# Altium project Power Distribution Board.PrjPcb
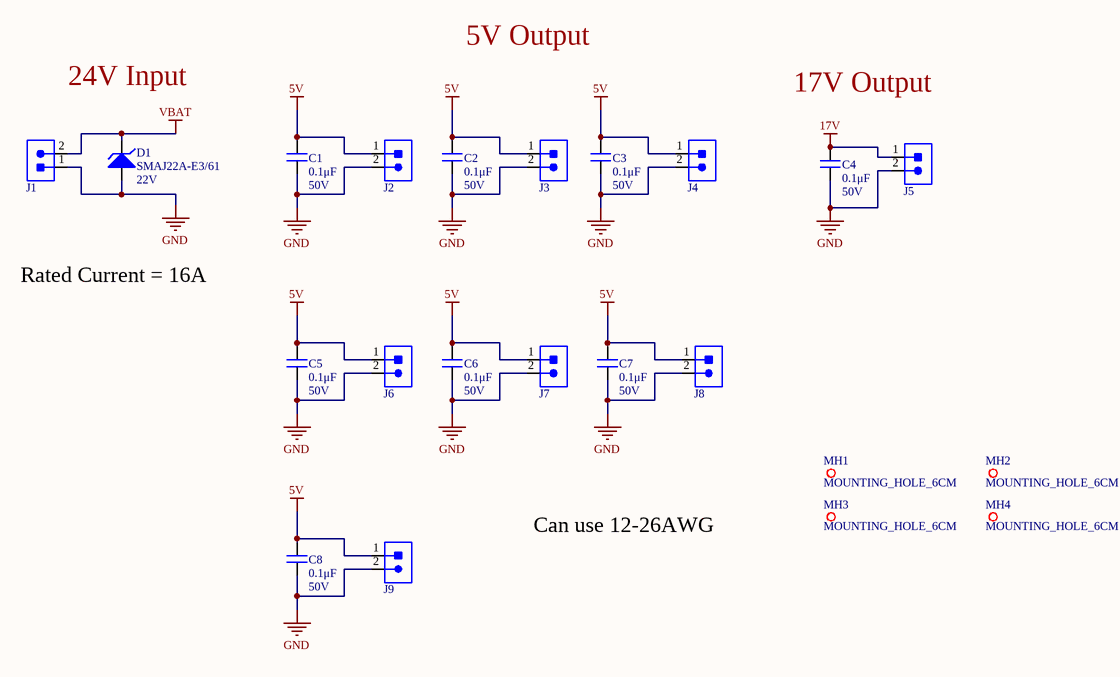
[diagram p0: SH1 - CONNECTORS.SchDoc]
BoardName: PDB
3 sheets, 83 parts. Net scope: global (net labels, ports and power ports of the same name join across sheets).
Board file: Power Distribution Board.PcbDoc
Sheets:
  SH1 - CONNECTORS.SchDoc
  SH2 - 5V VICOR DCDC.SchDoc
  SH3 - 17V BUCK CONVERTER.SchDoc

## Sheet SH1 - CONNECTORS.SchDoc: Connectors
size Letter; DrawnBy: Adrianna Ascalon; Organization: UW Robotics; Address1: 200 University Avenue; Address2: Waterloo; Address3: Ontario; Address4: Canada N2L 3G6; SheetNumber: 1; SheetTotal: 3

### Parts
C1  0.1μF  Voltage Rating: 50V  [CAPC2012X140N]
C2  0.1μF  Voltage Rating: 50V  [CAPC2012X140N]
C3  0.1μF  Voltage Rating: 50V  [CAPC2012X140N]
C4  0.1μF  Voltage Rating: 50V  [CAPC2012X140N]
C5  0.1μF  Voltage Rating: 50V  [CAPC2012X140N]
C6  0.1μF  Voltage Rating: 50V  [CAPC2012X140N]
C7  0.1μF  Voltage Rating: 50V  [CAPC2012X140N]
C8  0.1μF  Voltage Rating: 50V  [CAPC2012X140N]
D1  Reverse Standoff Voltage: 22V  [DO-214AC_UNI]  (hidden comment: SMAJ22A-E3/61)
J1  1935161  [1935161]  (value not drawn)
J2  1935161  [1935161]  (value not drawn)
J3  1935161  [1935161]  (value not drawn)
J4  1935161  [1935161]  (value not drawn)
J5  1935161  [1935161]  (value not drawn)
J6  1935161  [1935161]  (value not drawn)
J7  1935161  [1935161]  (value not drawn)
J8  1935161  [1935161]  (value not drawn)
J9  1935161  [1935161]  (value not drawn)
MH1  MOUNTING_HOLE_6CM  [MOUNTING_HOLE]
MH2  MOUNTING_HOLE_6CM  [MOUNTING_HOLE]
MH3  MOUNTING_HOLE_6CM  [MOUNTING_HOLE]
MH4  MOUNTING_HOLE_6CM  [MOUNTING_HOLE]

### Nets
5V: C1.2 C2.2 C3.2 C5.2 C6.2 C7.2 C8.2 J2.1 J3.1 J4.1 J6.1 J7.1 J8.1 J9.1
17V: C4.2 J5.1
GND: C1.1 C2.1 C3.1 C4.1 C5.1 C6.1 C7.1 C8.1 D1.1 J1.1 J2.2 J3.2 J4.2 J5.2 J6.2 J7.2 J8.2 J9.2
VBAT: D1.2 J1.2

### Notes on the sheet
- 5V Output
- 24V Input
- 17V Output
- Rated Current = 16A
- Can use 12-26AWG
- Title
- Size:
- Date:
- Letter
- Drawn By:
- Sheet
- of
- File:

### Library data of the parts
C1-C8 = CAP_0.1uF_50V_0805: CAP CER 0.1UF 50V X7R 0805; Manufacturer 1: Murata Electronics; Manufacturer Part Number 1: GCD21BR71H104KA01L; Tolerance: 10%; Mount: Surface Mount; Case Code (Metric): 2012; Case Code (Imperial): 0805; Min Operating Temperature: -55°C; Max Operating Temperature: 125°C; Dielectric: X7R; Termination: SMD/SMT; Length: 2mm; Height: 1.25mm; Width: 0.049inch; Thickness: 0.049inch; Depth: 1.25mm; Ratings: AEC-Q200; Supplier 1: Digi-Key; Supplier Part Number 1: 490-11955-1-ND; Package: 0805 (2012 Metric); Value: 0.1μF
D1 = SMAJ22A-E3/61: TVS DIODE 22V 35.5VC SMA; Manufacturer 1: Vishay Semiconductors; Clamping Voltage: 35.5V; Peak Pulse Power: 400W; Polarity: Unidirectional; Peak Pulse Current: 11.3A; Test Current: 1mA; Breakdown Voltage: 24.4V; Number of Channels: 1; Leakage Current: 1uA; Element Configuration: Single; Max Breakdown Voltage: 26.9V; Max Forward Surge Current (Ifsm): 40A; Working Voltage: 3.5V; Current: 113A; Supplier 1: Digi-Key; Case/Package: SMA; Number of Pins: 2; Min Operating Temperature: -55°C; Max Operating Temperature: 150°C; Max Surge Current: 11.3A; Operating Supply Voltage: 22V; Min Breakdown Voltage: 24.4V; Number of Elements: 1; Reverse Breakdown Voltage: 24.4V; Direction: Unidirectional; Termination: SMD/SMT; Max Reverse Leakage Current: 1uA; Max Power Dissipation: 400W; Voltage Rating (DC): 22V; Power Dissipation: 400W; Voltage: 22V; Length: 0.177inch; Height: 0.09inch; Width: 0.11inch; REACH SVHC: Unknown; Supplier Part Number 1: SMAJ22A-E3/61GICT-ND; Manufacturer Part Number 1: SMAJ22A-E3/61
J1 = CON_2M_TERM: TERM BLK 2POS SIDE ENTRY 5MM; Manufacturer 1: Phoenix Contact; Voltage: 300V; Current: 18A; Connector Type: Screw; Voltage Rating (DC): 320V; Max Current Rating: 16A; Max Supply Voltage: 250V; Current Rating: 17.5A; Number of Poles: 2; Number of Levels: 1; Wire Gauge (Max): 26AWG; Wire Gauge (Min): 12AWG; Approvals: UL; Supplier 1: Digi-Key; Pitch: 5mm; Manufacturer Part Number 1: 1935161; Supplier Part Number 1: 277-1667-ND; Mount: Through Hole; Number of Pins: 2; Weight: 0.067021oz; Contact Material: Copper,Tin; Insulation Material: Nylon; Housing Material: Polyamide; Housing Color: Green; Color: Green; Material: Nylon; Number of Rows: 1; Voltage Rating: 250V; Number of Positions: 2; Number of Positions Per Level: 2; Termination: Solder; Number of Contacts: 2; Number of Circuits: 2; Orientation: Straight; Length: 9mm; Height: 11.3mm; Width: 14.9mm; Depth: 9mm; Wire/Cable Gauge: 26AWG; Flammability Rating: UL94 V-0; REACH SVHC: Unknown
J2-J9 = CON_2M_TERM: TERM BLK 2POS SIDE ENTRY 5MM; Manufacturer 1: Phoenix Contact; Connector Type: Screw; Voltage Rating (DC): 320V; Max Current Rating: 16A; Max Supply Voltage: 250V; Current Rating: 17.5A; Number of Poles: 2; Number of Levels: 1; Current: 18A; Voltage: 300V; Wire Gauge (Max): 26AWG; Wire Gauge (Min): 12AWG; Approvals: UL; Supplier 1: Digi-Key; Mount: Through Hole; Number of Pins: 2; Weight: 0.067021oz; Contact Material: Copper,Tin; Insulation Material: Nylon; Housing Material: Polyamide; Housing Color: Green; Color: Green; Material: Nylon; Number of Rows: 1; Voltage Rating: 250V; Number of Positions: 2; Number of Positions Per Level: 2; Termination: Solder; Number of Contacts: 2; Number of Circuits: 2; Orientation: Straight; Length: 9mm; Height: 11.3mm; Width: 14.9mm; Pitch: 5mm; Depth: 9mm; Wire/Cable Gauge: 26AWG; Flammability Rating: UL94 V-0; REACH SVHC: Unknown; Supplier Part Number 1: 277-1667-ND; Manufacturer Part Number 1: 1935161

## Sheet SH2 - 5V VICOR DCDC.SchDoc: 5V Vicor Power Supply
size Letter; DrawnBy: Adrianna Ascalon; Organization: UW Robotics; Address1: 200 University Avenue; Address2: Waterloo; Address3: Ontario; Address4: Canada N2L 3G6; SheetNumber: 2; SheetTotal: 3
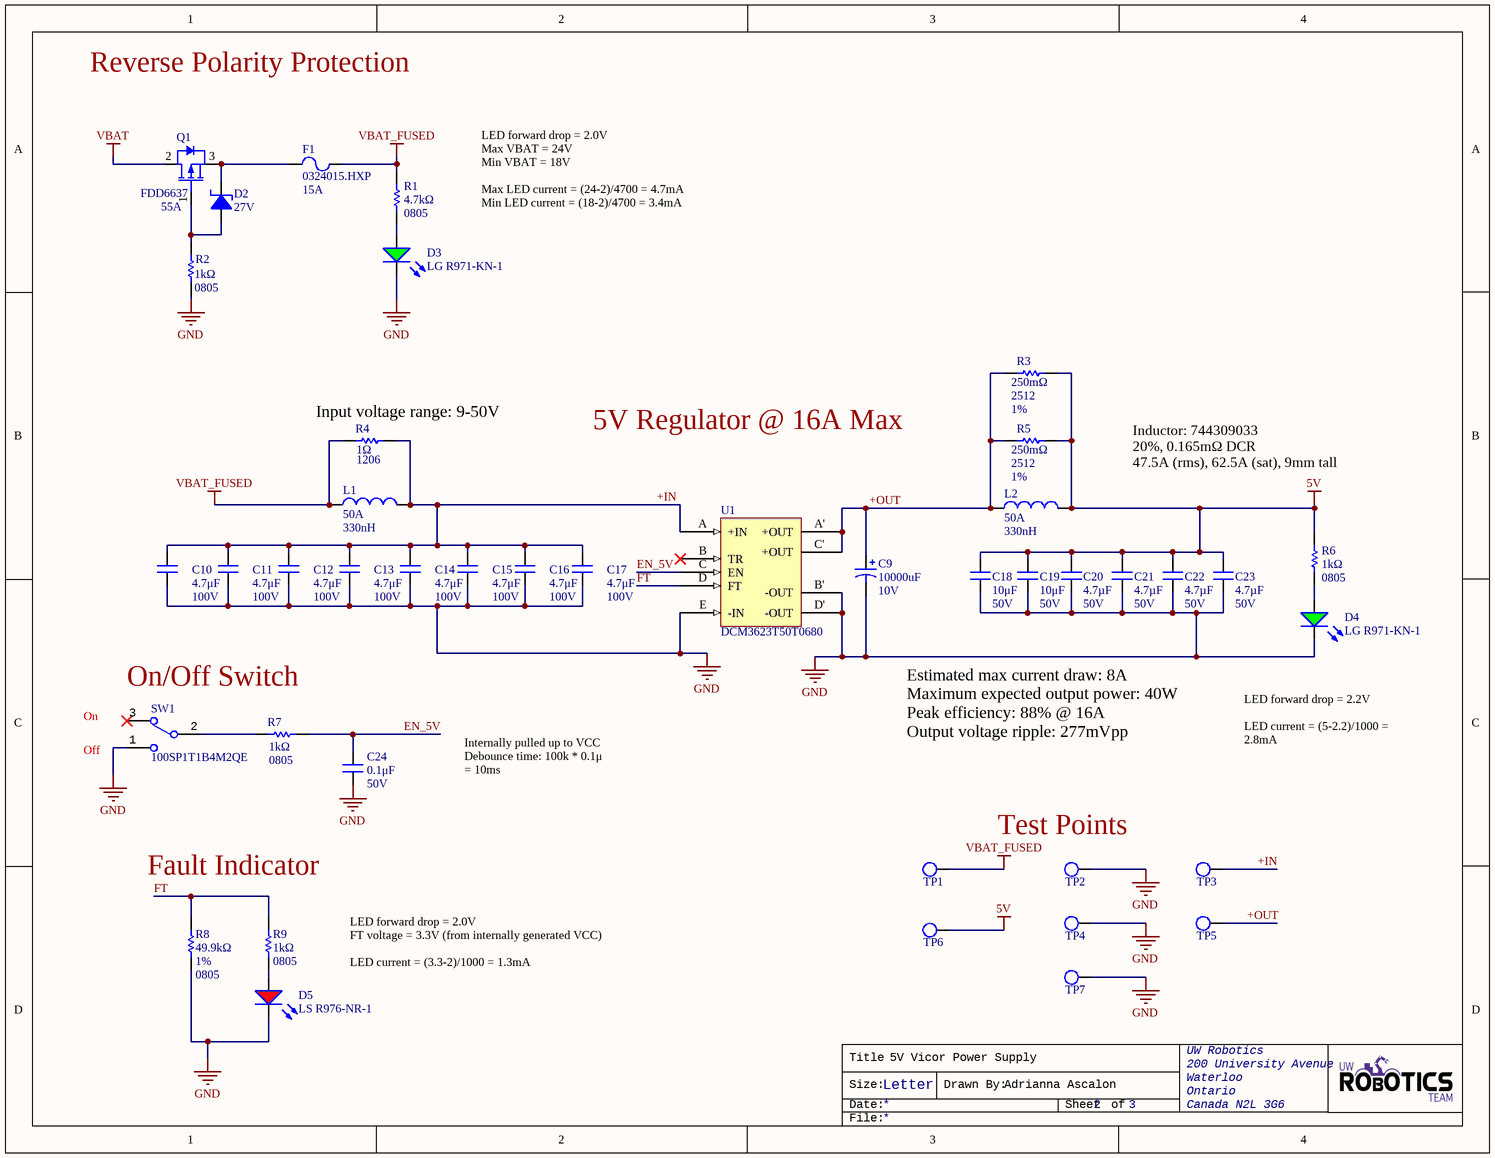
[diagram p1: SH2 - 5V VICOR DCDC.SchDoc]

### Parts
C9  Capacitance: 10000uF  Voltage Rating: 10V  [CAP_UBY_18X25_NC]  (hidden comment: URS1A103MHD1TN)
C10  4.7μF  Voltage Rating: 100V  [CAPC5750X7R2A]
C11  4.7μF  Voltage Rating: 100V  [CAPC5750X7R2A]
C12  4.7μF  Voltage Rating: 100V  [CAPC5750X7R2A]
C13  4.7μF  Voltage Rating: 100V  [CAPC5750X7R2A]
C14  4.7μF  Voltage Rating: 100V  [CAPC5750X7R2A]
C15  4.7μF  Voltage Rating: 100V  [CAPC5750X7R2A]
C16  4.7μF  Voltage Rating: 100V  [CAPC5750X7R2A]
C17  4.7μF  Voltage Rating: 100V  [CAPC5750X7R2A]
C18  value 10μF  Voltage Rating: 50V  [CAPC1206(3216)]  (hidden comment: 10uF)
C19  value 10μF  Voltage Rating: 50V  [CAPC1206(3216)]  (hidden comment: 10uF)
C20  4.7µF  Voltage: 50V  [CAPC1206(3216)]
C21  4.7µF  Voltage: 50V  [CAPC1206(3216)]
C22  4.7µF  Voltage: 50V  [CAPC1206(3216)]
C23  4.7µF  Voltage: 50V  [CAPC1206(3216)]
C24  0.1μF  Voltage Rating: 50V  [CAPC2012X140N]
D2  Working Voltage: 27V  [SOT23-3]  (hidden comment: DIO_ZENER_27V)
D3  LG R971-KN-1  [LED_0805_LINE]
D4  LG R971-KN-1  [LED_0805_LINE]
D5  LS R976-NR-1  [LED_0805_LINE]
F1  0324015.HXP  Current Rating: 15A  [FUSE]
L1  Max DC Current: 50A  Inductance: 330nH  [WE-HCM 1390]  (hidden comment: 744309033)
L2  Max DC Current: 50A  Inductance: 330nH  [WE-HCM 1390]  (hidden comment: 744309033)
Q1  Continuous Drain Current (ID): 55A  [D-PAK]  (hidden comment: FDD6637)
R1  value 4.7kΩ  Case Code (Imperial): 0805  [RESC2012X60N]  (hidden comment: RES_4.7kΩ_0805)
R2  1kΩ  Case Code (Imperial): 0805  [RESC2012X60N]
R3  Package Reference: 2512  Resistance Tolerance: 1%  Resistance: 250mΩ  [RESC6432X89X76NL25T25]  (hidden comment: WSL2512R2500FEA)
R4  Case Code (Imperial): 1206  Resistance: 1Ω  [RESC1206(3216)_N]  (hidden comment: RES_1Ω_1206)
R5  Package Reference: 2512  Resistance Tolerance: 1%  Resistance: 250mΩ  [RESC6432X89X76NL25T25]  (hidden comment: WSL2512R2500FEA)
R6  1kΩ  Case Code (Imperial): 0805  [RESC2012X60N]
R7  1kΩ  Case Code (Imperial): 0805  [RESC2012X60N]
R8  49.9kΩ  Tolerance: 1%  Case Code (Imperial): 0805  [RESC2012X60N]
R9  1kΩ  Case Code (Imperial): 0805  [RESC2012X60N]
SW1  100SP1T1B4M2QE  [100SP1T1B4M2QE]
TP1  TESTPOINT_LOOP  [TESTPOINT_LOOP]  (value not drawn)
TP2  TESTPOINT_LOOP  [TESTPOINT_LOOP]  (value not drawn)
TP3  TESTPOINT_LOOP  [TESTPOINT_LOOP]  (value not drawn)
TP4  TESTPOINT_LOOP  [TESTPOINT_LOOP]  (value not drawn)
TP5  TESTPOINT_LOOP  [TESTPOINT_LOOP]  (value not drawn)
TP6  TESTPOINT_LOOP  [TESTPOINT_LOOP]  (value not drawn)
TP7  TESTPOINT_LOOP  [TESTPOINT_LOOP]  (value not drawn)
U1  DCM3623T50T0680  [DCM3623T50T0680]

### Nets
5V: C18.2 C19.2 C20.2 C21.2 C22.2 C23.2 L2.2 R3.2 R5.2 R6.2 TP6.1
GND: C9.2 C10.1 C11.1 C12.1 C13.1 C14.1 C15.1 C16.1 C17.1 C18.1 C19.1 C20.1 C21.1 C22.1 C23.1 C24.1 D3.2(K) D4.2(K) D5.2(K) R2.1 R8.2 SW1.1 TP2.1 TP4.1 TP7.1 U1.B'(-OUT) U1.D'(-OUT) U1.E(-IN)
VBAT: Q1.2(Drain)
VBAT_FUSED: F1.2 L1.1 R1.2 R4.1 TP1.1
+IN: C10.2 C11.2 C12.2 C13.2 C14.2 C15.2 C16.2 C17.2 L1.2 R4.2 TP3.1 U1.A(+IN)
+OUT: C9.1 L2.1 R3.1 R5.1 TP5.1 U1.A'(+OUT) U1.C'(+OUT)
EN_5V: C24.2 R7.2 U1.C(EN)
FT: R8.1 R9.2 U1.D(FT)
NetD2_1: D2.1(Anode) Q1.1(Gate) R2.2
NetD2_2: D2.2(Cathode) F1.1 Q1.3(Source)
NetD3_1: D3.1(A) R1.1
NetD4_1: D4.1(A) R6.1
NetD5_1: D5.1(A) R9.1
NetR7_1: R7.1 SW1.2

Not connected (* = marked no-connect by the designer): SW1 3*; U1 B(TR)*

### Notes on the sheet
- Reverse Polarity Protection
- LED forward drop = 2.0V
  Max VBAT = 24V
  Min VBAT = 18V
  Max LED current = (24-2)/4700 = 4.7mA
  Min LED current = (18-2)/4700 = 3.4mA
- (near R4) Input voltage range: 9-50V
- 5V Regulator @ 16A Max
- Inductor: 744309033
  20%, 0.165mΩ DCR
  47.5A (rms), 62.5A (sat), 9mm tall
- On/Off Switch
- (near SW1) Off
- On
- Internally pulled up to VCC
  Debounce time: 100k * 0.1μ = 10ms
- Estimated max current draw: 8A
  Maximum expected output power: 40W
  Peak efficiency: 88% @ 16A
  Output voltage ripple: 277mVpp
- LED forward drop = 2.2V
  LED current = (5-2.2)/1000 = 2.8mA
- (near TP2) Test Points
- Fault Indicator
- LED forward drop = 2.0V
  FT voltage = 3.3V (from internally generated VCC)
  LED current = (3.3-2)/1000 = 1.3mA
- Title
- Size:
- Date:
- Letter
- Drawn By:
- Sheet
- of
- File:

### Library data of the parts
C9 = URS1A103MHD1TN: CAP ALUM 10000UF 20% 10V RADIAL; Manufacturer 1: Nichicon; Ripple Current: 2.35A; Life (Hours): 2000Hour; Supplier 1: Digi-Key; Manufacturer Part Number 1: URS1A103MHD1TN; Mount: Through Hole; Case/Package: Radial; Min Operating Temperature: -40°C; Max Operating Temperature: 85°C; Tolerance: 20%; Lead Pitch: 0.295inch; Height - Seated (Max): 1.043inch; Supplier Part Number 1: 493-12364-1-ND
C10-C17 = CAP_4.7uF_100V_2220: CAP CER 4.7UF 100V X7R 2220; Manufacturer: TDK; Manufacturer Part Number: C5750X7R2A475M230KA; Tolerance: 20%; Supplier Part Number 1: 445-1450-1-ND; Supplier 1: Digi-Key; Category: Ceramic Capacitors; Mount: Surface Mount; Number of Pins: 2; Weight: 0.016932oz; Case Code (Metric): 5750; Case Code (Imperial): 2220; Min Operating Temperature: -55°C; Max Operating Temperature: 125°C; Termination: SMD/SMT; Voltage: 100V; Voltage Rating (DC): 100V; Dielectric: X7R; Composition: Ceramic; Length: 5.7mm; Height: 2.3mm; Depth: 5mm; Width: 0.197inch; Thickness: 0.098inch; REACH SVHC: No SVHC; Capacitor Value: 4.7μF; Package: 2220 (5750 Metric); Value: 4.7μF
C18 C19 = CAP_10uF_50V_1206: CAP CER 10UF 50V X5R 1206; Manufacturer Part Numer 1: GRT31CR61H106KE01L; Manufacturer 1: Murata; Dimensions: 0.126" L x 0.063" W (3.20mm x 1.6mm); Package: 1206 (3216 Metric); Supplier Part Number 1: 490-12456-1-ND; Supplier 1: Digi-Key; Mount: Surface Mount; Case Code (Imperial): 1206; Case Code (Metric): 3216; Dielectric: X5R; Manufacturer Part Number 1: GRT31CR61H106KE01L
C20-C23 = CAP_4.7µF_50V_1206: CAP CER 4.7UF 50V X7R 1206; Manufacturer 1: Murata; Manufacturer Part Number 1: GRM31CR71H475KA12L; Material: Ceramic; Tolerance: 10%; Capacitance: 4.7uF; Voltage Rating: 50V; Supplier 1: Digi-Key; Mount: Surface Mount; Case Code (Metric): 3216; Case Code (Imperial): 1206; Min Operating Temperature: -55°C; Max Operating Temperature: 125°C; Voltage Rating (DC): 50V; Termination: SMD/SMT; Dielectric: X7R; Length: 3.2mm; Height: 1.6mm; Width: 0.063inch; Thickness: 0.071inch; Depth: 1.6mm; REACH SVHC: No SVHC; ComponentLink7URL: https://datasheet.ciiva.com/6270/partnumbering-e-01-6270217.pdf?src-supplier=Digi-Key; ComponentLink7Description: https://datasheet.ciiva.com/6270/partnumbering-e-01-6270217.pdf?src-supplier=Digi-Key; ComponentLink8URL: https://datasheet.ciiva.com/6270/partnumbering-e-01-6270218.pdf?src-supplier=Digi-Key; ComponentLink8Description: https://datasheet.ciiva.com/6270/partnumbering-e-01-6270218.pdf?src-supplier=Digi-Key; Supplier Part Number 1: 490-6521-1-ND; Package: 1206 (3216 Metric)
C24 = CAP_0.1uF_50V_0805: CAP CER 0.1UF 50V X7R 0805; Manufacturer Part Number 1: GCD21BR71H104KA01L; Manufacturer 1: Murata Electronics; Tolerance: 10%; Package: 0805 (2012 Metric); Supplier Part Number 1: 490-11955-1-ND; Supplier 1: Digi-Key; Mount: Surface Mount; Value: 0.1μF; Case Code (Imperial): 0805; Case Code (Metric): 2012; Dielectric: X7R; Min Operating Temperature: -55°C; Max Operating Temperature: 125°C; Termination: SMD/SMT; Length: 2mm; Height: 1.25mm; Width: 0.049inch; Thickness: 0.049inch; Depth: 1.25mm; Ratings: AEC-Q200
D2 = DIO_ZENER_27V: DIODE ZENER 27V 250MW SOT23; Manufacturer 1: Nexperia USA Inc.; Manufacturer Part Number 1: BZX84-C27,215; Tolerance: 5%; Forward Voltage: 0.9V; Supplier Part Number 1: 1727-5026-2-ND; Supplier 1: Digi-Key; Mount: Surface Mount; Package/Case: SOT-23-3
D3 D4 = DIO_LED_G: LED GREEN DIFFUSED 0805 SMD; Manufacturer 1: OSRAM; Forward Voltage Drop: 2.2V; Package: 0805 (2012 Metric); Manufacturer Part Number 1: LG R971-KN-1; Supplier Part Number 1: 475-1410-1-ND; Supplier 1: Digi-Key; Mount: Surface Mount
D5 = DIO_LED_R: LED RED DIFFUSED 0805 SMD; Manufacturer 1: OSRAM; Forward Voltage Drop: 2V; Package: 0805 (2012 Metric); Manufacturer Part Number 1: LS R976-NR-1; Supplier Part Number 1: 475-1278-1-ND; Supplier 1: Digi-Key; Mount: Surface Mount
F1 = 0324015.HXP: FUSE CERM 15A 250VAC 125VDC 3AB; Manufacturer 1: Littelfuse; Fuse Type: Cartridge, Ceramic; Voltage Rating (DC): 125V; Voltage Rating (AC): 250V; DC Cold Resistance: 5.05mR; Approvals: UL,CSA,CE,K-Mark; Supplier 1: Digi-Key; Manufacturer Part Number 1: 0324015.HXP; Mount: Through Hole; Case/Package: Axial; Housing Material: Ceramic; Min Operating Temperature: -55°C; Max Operating Temperature: 125°C; Termination: Axial; Fuse Current: 15A; Resistance: 5.05mR; Working Voltage: 250V; Diameter: 6.985mm; Length: 1.288inch; REACH SVHC: Unknown; Supplier Part Number 1: F1870-ND
L1 L2 = 744309033: IND 330NH 47.5A 0.165 MOHM; Manufacturer 1: Wurth Electronics; Core Material: Zinc; Inductance Tolerance: 20%; Self Resonant Frequency: 158MHz; Saturation Current: 62.5A; Shielding: Shielded; DC Resistance (DCR): 0.165mR; Test Frequency: 100kHz; Supplier 1: Newark; Manufacturer Part Number 1: 744309033; Mount: Surface Mount; Case/Package: Nonstandard; Min Operating Temperature: -40°C; Max Operating Temperature: 125°C; Current Rating: 47.5A; Tolerance: 20%; Composition: Wirewound; Termination: SMD/SMT; RMS Current (Irms): 50A; Length: 0.551inch; Height: 9mm; Width: 0.512inch; Height - Seated (Max): 0.374inch; REACH SVHC: Unknown
Q1 = FDD6637: MOSFET P-CH 35V 13A DPAK; Manufacturer 1: ON Semiconductor / Fairchild; Rds On Max: 11.6mR; Input Capacitance: 2.37nF; Max Power Dissipation: 57W; Rise Time: 10ns; Fall Time: 36ns; Turn-Off Delay Time: 62ns; Turn-On Delay Time: 18ns; Gate to Source Voltage (Vgs): 25V; Element Configuration: Single; Number of Elements: 1; Power Dissipation: 3.1W; Drain to Source Breakdown Voltage: -35V; Threshold Voltage: -1.6V; Supplier 1: Digi-Key; Mount: Surface Mount; Case/Package: TO-252; Number of Pins: 3; Weight: 0.26037g; Min Operating Temperature: -55°C; Max Operating Temperature: 150°C; Drain to Source Voltage (Vdss): 35V; Drain to Source Resistance: 11.6mR; Nominal Vgs: -1.6V; On-State Resistance: 11.6MR; Length: 6.73mm; Height: 2.39mm; Width: 6.22mm; REACH SVHC: No SVHC; ComponentLink7URL: https://datasheet.ciiva.com/28548/686553-28548172.pdf?src-supplier=Element14; ComponentLink7Description: https://datasheet.ciiva.com/28548/686553-28548172.pdf?src-supplier=Element14; ComponentLink8URL: https://datasheet.ciiva.com/6382/fdd6637-6382456.pdf?src-supplier=Digi-Key; ComponentLink8Description: https://datasheet.ciiva.com/6382/fdd6637-6382456.pdf?src-supplier=Digi-Key; ComponentLink9URL: https://datasheet.ciiva.com/6382/fdd6637-6382457.pdf?src-supplier=Digi-Key; ComponentLink9Description: https://datasheet.ciiva.com/6382/fdd6637-6382457.pdf?src-supplier=Digi-Key; Supplier Part Number 1: FDD6637CT-ND; Manufacturer Part Number 1: FDD6637
R1 = RES_4.7kΩ_0805: RES SMD 4.7K OHM 5% 1/8W 0805; Manufacturer 1: Yageo; Manufacturer Part Number 1: RC0805JR-074K7L; Resistance: 4.7kR; Temperature Coefficient: 100ppm/°C; Power Rating: 125mW; Voltage Rating: 150V; Supplier 1: Digi-Key; Contact Plating: Tin,Lead,Matte; Case Code (Metric): 2012; Min Operating Temperature: -55°C; Max Operating Temperature: 155°C; Tolerance: 5%; Composition: Thick Film; Termination: SMD/SMT; Military Standard: Not; Length: 2mm; Depth: 1.25mm; REACH SVHC: Unknown; Supplier Part Number 1: 311-4.7KARCT-ND; Mount: Surface Mount; Package: 0805 (2012 Metric)
R2 R6 R9 = RES_1kΩ_0805: RES SMD 1K OHM 1% 1/8W 0805; Manufacturer 1: Yageo; Manufacturer Part Number 1: RC0805FR-071KL; Power Rating: 125mW; Temperature Coefficient: 25ppm/°C; Voltage Rating: 150V; Package: 0805 (2012 Metric); Supplier Part Number 1: 311-1.00KCRCT-ND; Supplier 1: Digi-Key; Case Code (Metric): 2012; Tolerance: 1%; Value: 1kΩ; Min Operating Temperature: -55°C; Max Operating Temperature: 155°C; Resistance: 1K; Termination: SMD/SMT; Mount: Surface Mount; Case/Package: 0805; Number of Pins: 2; Weight: 0.000194oz; Contact Plating: Tin; Composition: Thin Film; Number of Terminations: 2; Voltage Rating (DC): 150V; Max Power Dissipation: 125mW; Features: Moisture Resistant,Automotive AEC-Q200,Anti-Sulfur; Military Standard: Not; Length: 2mm; Height: 0.022inch; Width: 0.049inch; Depth: 1.25mm; REACH SVHC: Unknown
R3 R5 = RES_250mΩ_2512: RES 0.25 OHM 1% 1W 2512; Manufacturer: Vishay; Automotive Qualification Standard: AEC-Q200; Temperature Coefficient: ±75ppm/°C; Resistor Case Style: 2512[6432Metric]; SVHC: NoSVHC(15-Jun-2015); Product Range: WSLSeries; Resistor Element Type: MetalStrip; Power Rating: 1W; Manufacturer URL: http://www.vishay.com/; Datasheet Version: 07/2016; Datasheet URL: http://www.vishay.com/docs/30100/wsl.pdf; Mounting Technology: SurfaceMount; MSL: MSL1-Unlimited; Package Description: 2-Pin Surface Mount Device, Body 6.35 x 3.18 mm; Case Code (Imperial): 2512; Case Code (Metric): 6432; Package: 2512 (6432 Metric)
R4 = RES_1Ω_1206: RES 1 OHM 5% 1/4W 1206; Manufacturer: KOA Speer; Manufacturer Part Number: RK73B2BTTE1R0J; Power Rating: 250mW; Voltage Rating: 200V; Temperature Coefficient: 200ppm/°C; Supplier 1: Digi-Key; Category: Chip SMD Resistors; Case Code (Metric): 3216; Min Operating Temperature: -55°C; Max Operating Temperature: 155°C; Tolerance: 5%; Termination: SMD/SMT; Composition: Thick Film; Length: 3.2mm; Height: 0.6mm; Width: 1.6mm; Supplier Part Number 1: 2019-RK73B2BTTE1R0JCT-ND; Package: 1206 (3216 Metric)
R7 = RES_100kΩ_0805: RES SMD 100K OHM 0.5% 1/8W 0805; Manufacturer 1: Panasonic; Manufacturer Part Number 1: ERA-6AED104V; Resistance: 100kΩ; Power Rating: 125mW; Temperature Coefficient: 25ppm/°C; Voltage Rating: 200V; Package: 0805 (2012 Metric); Supplier Part Number 1: P123795CT-ND; Supplier 1: Digi-Key; Case Code (Metric): 2012; Tolerance: 0.5%; Min Operating Temperature: -55°C; Max Operating Temperature: 155°C; Termination: SMD/SMT; Mount: Surface Mount; Contact Plating: Tin; Composition: Thin Film; Military Standard: Not; Length: 2mm; Height: 0.5mm; Width: 1.25mm; Depth: 1.25mm; Category: Chip SMD Resistors
R8 = RES_49.9kΩ_0805: RES SMD 49.9K OHM 1% 1/8W 0805; Manufacturer Part Number 1: TNPW080549K9BEEN; Manufacturer 1: Vishay Dale; Power Rating: 125mW; Voltage Rating: 150V; Temperature Coefficient: 25ppm/°C; Resistance: 49.9kR; Supplier 1: Digi-Key; Mount: Surface Mount; Number of Pins: 2; Min Operating Temperature: -55°C; Max Operating Temperature: 125°C; Composition: Thin Film; Termination: SMD/SMT; Military Standard: Not; Voltage Rating (DC): 150V; Length: 2mm; Height: 0.022inch; Width: 0.049inch; Supplier Part Number 1: 541-3802-1-ND; Package: 0805 (2012 Metric); Case Code (Metric): 2012; Depth: 1.25mm; Weight: 0.000194oz; Contact Plating: Tin; Number of Terminations: 2; Max Power Dissipation: 125mW; Features: Moisture Resistant,Automotive AEC-Q200,Anti-Sulfur; REACH SVHC: Unknown
SW1 = SW_SPDT: SWITCH TOGGLE SPDT 5A 120V; Manufacturer 1: E-Switch; Actuator Material: Brass,Chrome; Electrical Life: 40000Cycles; Actuator Type: Standard Round; Voltage Rating (DC): 28V; Illumination Type: Non-Illuminated,Illuminated; Switch Function: On-On; Actuator Length: 12.19mm; Supplier 1: Digi-Key; Manufacturer Part Number 1: 100SP1T1B4M2QE; Mount: Through Hole; Contact Material: Silver; Contact Plating: Silver; Min Operating Temperature: -30°C; Max Operating Temperature: 85°C; Termination: PC Pin; Throw Configuration: SPDT; Orientation: Vertical; Voltage Rating (AC): 120V; Supplier Part Number 1: EG2355-ND; Current Rating: 5A
TP1-TP7 = TESTPOINT_LOOP: PC TEST POINT MINIATURE WHITE; Manufacturer 1: Keystone Electronics; Manufacturer Part Number 1: 5002; Supplier Part Number 1: 36-5002-ND; Supplier 1: Digi-Key; Mount: Through Hole
U1 = DCM3623T50T0680: DC DC CONVERTER 5V 80W

## Sheet SH3 - 17V BUCK CONVERTER.SchDoc: 17V Buck Converter
size Letter; DrawnBy: Adrianna Ascalon; Organization: UW Robotics; Address1: 200 University Avenue; Address2: Waterloo; Address3: Ontario; Address4: Canada N2L 3G6; SheetNumber: 3; SheetTotal: 3
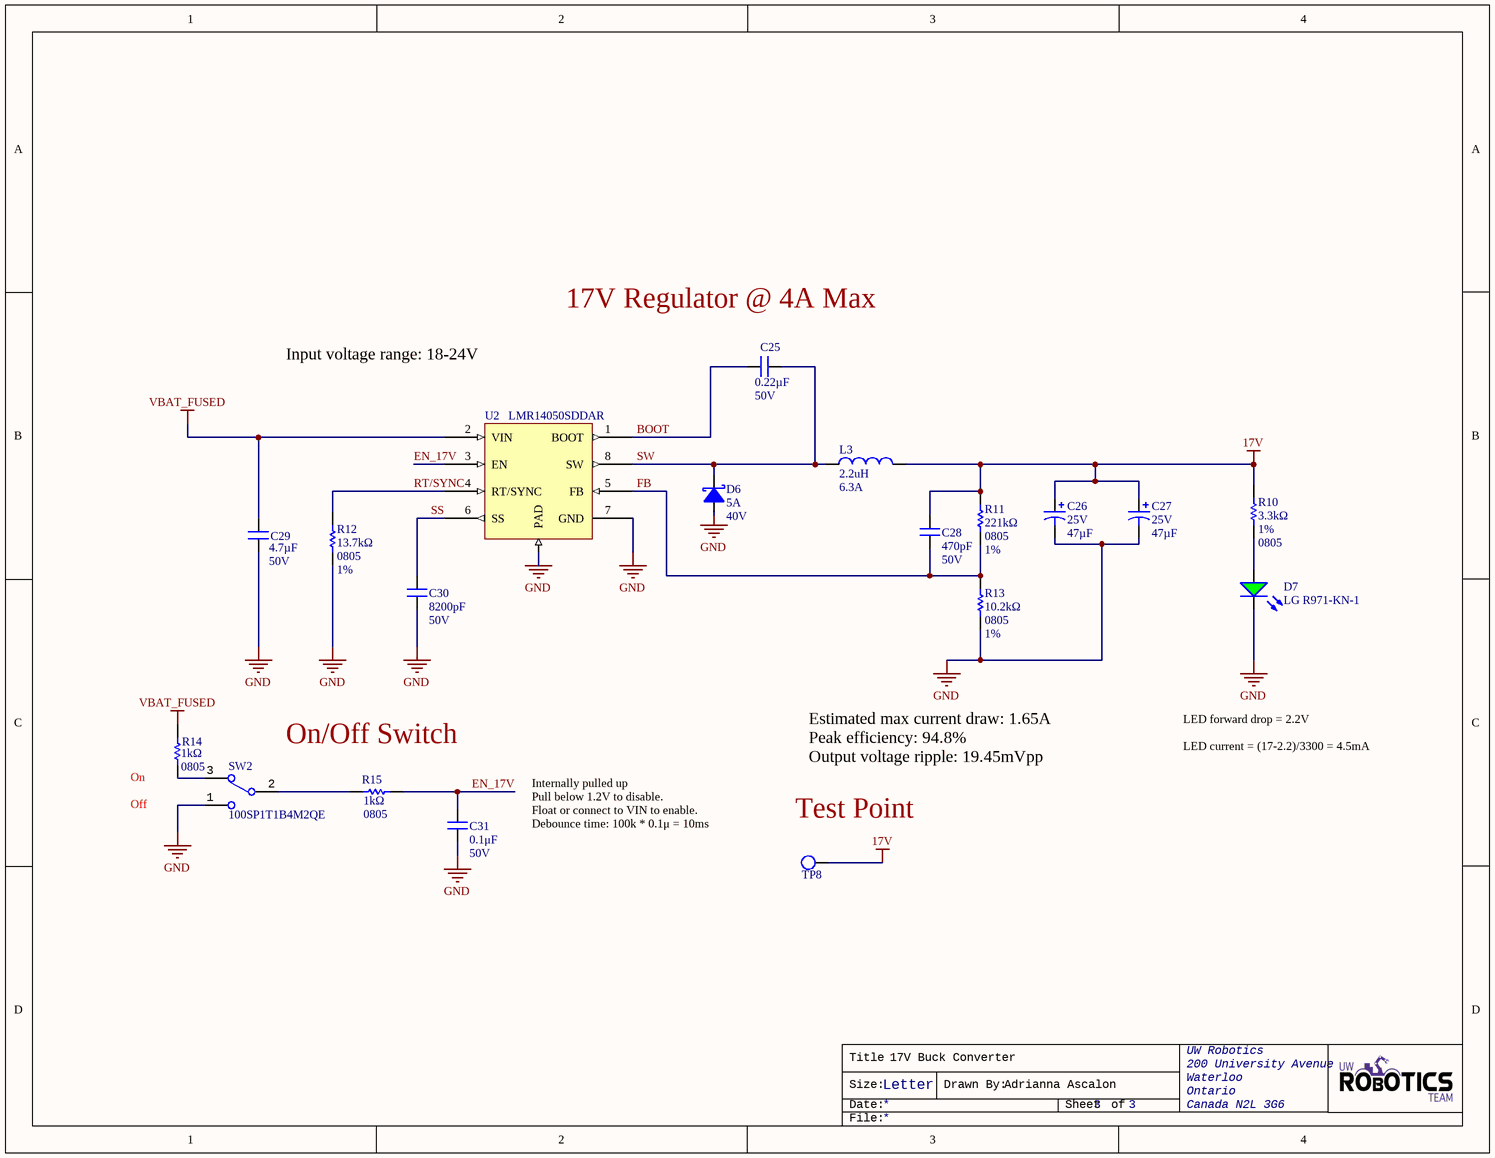
[diagram p2: SH3 - 17V BUCK CONVERTER.SchDoc]

### Parts
C25  Voltage Rating: 50V  Capacitance: 0.22µF  [CAP 0805_2012]  (hidden comment: GRM21BR71H224MA01L)
C26  Voltage: 25V  [25SVPF47M]  (hidden comment: 47μF)
C27  Voltage: 25V  [25SVPF47M]  (hidden comment: 47μF)
C28  470pF  Voltage Rating: 50V  [CAP 0805_2012]
C29  Voltage Rating: 50V  Capacitance: 4.7µF  [CAPC1206(3216)]  (hidden comment: GRM31CR71H475KA12L)
C30  8200pF  Voltage Rating: 50V  [CAP 0805_2012]
C31  0.1μF  Voltage Rating: 50V  [CAPC2012X140N]
D6  Forward Current: 5A  Voltage: 40V  [DO214AB SMC]  (hidden comment: B540C-13-F)
D7  LG R971-KN-1  [LED_0805_LINE]
L3  Inductance: 2.2uH  Max DC Current: 6.3A  [IND_BOURNS_SRN80]  (hidden comment: SRN8040-2R2Y)
R10  3.3kΩ  Tolerance: 1%  Case Code (Imperial): 0805  [RESC2012X60N]
R11  221kΩ  Case Code (Imperial): 0805  Tolerance: 1%  [RESC2012X60N]
R12  13.7kΩ  Case Code (Imperial): 0805  Tolerance: 1%  [RESC2012X60N]
R13  10.2kΩ  Case Code (Imperial): 0805  Tolerance: 1%  [RESC2012X60N]
R14  Case Code (Imperial): 0805  [RESC2012X60N]  (hidden comment: 1kΩ)
R15  1kΩ  Case Code (Imperial): 0805  [RESC2012X60N]
SW2  100SP1T1B4M2QE  [100SP1T1B4M2QE]
TP8  TESTPOINT_LOOP  [TESTPOINT_LOOP]  (value not drawn)
U2  LMR14050SDDAR  [8-PowerSOIC]

### Nets
17V: C26.1 C27.1 C28.2 L3.2 R10.2 R11.2 TP8.1
GND: C26.2 C27.2 C29.2 C30.1 C31.1 D6.1(Anode) D7.2(K) R12.1 R13.1 SW2.1 U2.7(GND) U2.9(PAD)
VBAT_FUSED: C29.1 R14.2 U2.2(VIN)
BOOT: C25.2 U2.1(BOOT)
EN_17V: C31.2 R15.2 U2.3(EN)
FB: C28.1 R11.1 R13.2 U2.5(FB)
RT/SYNC: R12.2 U2.4(RT/SYNC)
SS: C30.2 U2.6(SS)
SW: C25.1 D6.2(Cathode) L3.1 U2.8(SW)
NetD7_1: D7.1(A) R10.1
NetR14_1: R14.1 SW2.3
NetR15_1: R15.1 SW2.2

### Notes on the sheet
- Input voltage range: 18-24V
- (near C25) 17V Regulator @ 4A Max
- On/Off Switch
- Estimated max current draw: 1.65A
  Peak efficiency: 94.8%
  Output voltage ripple: 19.45mVpp
- LED forward drop = 2.2V
  LED current = (17-2.2)/3300 = 4.5mA
- (near R14) Off
- (near R14) On
- (near TP8) Test Point
- Internally pulled up
  Pull below 1.2V to disable.
  Float or connect to VIN to enable.
  Debounce time: 100k * 0.1μ = 10ms
- Title
- Size:
- Date:
- Letter
- Drawn By:
- Sheet
- of
- File:

### Library data of the parts
C25 = GRM21BR71H224MA01L: CAP CER 0.22UF 50V X7R 0805; Manufacturer 1: Murata; Tolerance: 20%; Manufacturer Part Number 1: GRM21BR71H224MA01L; Mount: Surface Mount; Case/Package: 0805; Case Code (Metric): 2012; Case Code (Imperial): 0805; Min Operating Temperature: -55°C; Max Operating Temperature: 125°C; Dielectric: X7R; Termination: SMD/SMT; Voltage Rating (DC): 50V; Length: 2mm; Height: 1.25mm; Width: 0.049inch; Thickness: 0.053inch; Depth: 1.25mm; Supplier 1: Digi-Key; Supplier Part Number 1: 490-1671-1-ND; Package: 0805 (2012 Metric)
C26 C27 = 25SVPF47M: CAP ALUM POLY 47UF 20% 25V SMD; Manufacturer 1: Panasonic; Polarity: Polar; Leakage Current: 235uA; Life (Hours): 5000Hour; Dissipation Factor: 12%; ESR (Equivalent Series Resistance): 30mR; Ripple Current: 2.8A; Clamping Voltage: 35.5V; Peak Pulse Power: 400W; Reverse Standoff Voltage: 22V; Peak Pulse Current: 11.3A; Test Current: 1mA; Breakdown Voltage: 24.4V; Number of Channels: 1; Direction: Unidirectional; Max Reverse Leakage Current: 1uA; Element Configuration: Single; Max Breakdown Voltage: 26.9V; Max Forward Surge Current (Ifsm): 40A; Working Voltage: 3.5V; Current: 113A; Supplier 1: Digi-Key; Manufacturer Part Number 1: 25SVPF47M; Mount: Surface Mount; Case/Package: Radial; Number of Pins: 6; Min Operating Temperature: -55°C; Max Operating Temperature: 105°C; Termination: SMD/SMT; Tolerance: 20%; Voltage Rating: 25V; Ripple Current (AC): 2.8A; Voltage Rating (DC): 25V; Diameter: 6.3mm; Length: 5.9mm; Height: 5.9mm; Height - Seated (Max): 0.236inch; REACH SVHC: No SVHC; Supplier Part Number 1: P16513CT-ND; Capacitance: 47µF; Max Surge Current: 11.3A; Operating Supply Voltage: 22V; Min Breakdown Voltage: 24.4V; Number of Elements: 1; Reverse Breakdown Voltage: 24.4V; Max Power Dissipation: 400W; Power Dissipation: 400W; Width: 0.11inch
C28 = CAP_470pF_50V_0805: CAP CER 470PF 50V X7R 0805; Manufacturer 1: Kyocera AVX; Manufacturer Part Number 1: 08055C471JAT2A; Tolerance: 5%; Dissipation Factor: 2.5%; Supplier 1: Digi-Key; Mount: Surface Mount; Number of Pins: 2; Case Code (Metric): 2012; Case Code (Imperial): 0805; Min Operating Temperature: -55°C; Max Operating Temperature: 125°C; Dielectric: X7R; Voltage Rating (DC): 50V; Termination: SMD/SMT; Length: 2.01mm; Height: 0.94mm; Width: 0.049inch; Thickness: 0.037inch; Depth: 1.25mm; REACH SVHC: Unknown; ComponentLink7URL: https://datasheet.ciiva.com/14906/cx7r-14906253.pdf?src-supplier=Digi-Key; ComponentLink7Description: https://datasheet.ciiva.com/14906/cx7r-14906253.pdf?src-supplier=Digi-Key; Supplier Part Number 1: 478-7958-1-ND; Capacitance: 470pF; Package: 0805 (2012 Metric); Contact Plating: Tin,Matte
C29 = GRM31CR71H475KA12L: CAP CER 4.7UF 50V X7R 1206; Manufacturer 1: Murata; Material: Ceramic; Tolerance: 10%; Value: 4.7µF; Supplier 1: Digi-Key; Manufacturer Part Number 1: GRM31CR71H475KA12L; Mount: Surface Mount; Case/Package: 1206; Case Code (Metric): 3216; Case Code (Imperial): 1206; Min Operating Temperature: -55°C; Max Operating Temperature: 125°C; Dielectric: X7R; Voltage Rating (DC): 50V; Termination: SMD/SMT; Voltage: 50V; Length: 3.2mm; Height: 1.6mm; Width: 0.063inch; Thickness: 0.071inch; Depth: 1.6mm; REACH SVHC: No SVHC; ComponentLink7URL: https://datasheet.ciiva.com/6270/partnumbering-e-01-6270218.pdf?src-supplier=Digi-Key; ComponentLink7Description: https://datasheet.ciiva.com/6270/partnumbering-e-01-6270218.pdf?src-supplier=Digi-Key; ComponentLink8URL: https://datasheet.ciiva.com/6270/partnumbering-e-01-6270219.pdf?src-supplier=Digi-Key; ComponentLink8Description: https://datasheet.ciiva.com/6270/partnumbering-e-01-6270219.pdf?src-supplier=Digi-Key; Supplier Part Number 1: 490-6521-1-ND; Package: 1206 (3216 Metric)
C30 = CAP_8200pF_50V_0805: CAP CER 8200PF 50V X7R 0805; Tolerance: 10%; Capacitance: 8.2nF; Mount: Surface Mount; Case Code (Metric): 2012; Case Code (Imperial): 0805; Min Operating Temperature: -55°C; Max Operating Temperature: 125°C; Dielectric: X7R; Voltage Rating (DC): 50V; Termination: SMD/SMT; Length: 0.079inch; Width: 0.049inch; Thickness: 0.037inch; Depth: 1.25mm; Supplier 1: Digi-Key; Supplier Part Number 1: 478-9924-6-ND; Number of Pins: 2; Ratings: AEC-Q200; Package: 0805 (2012 Metric)
C31 = CAP_0.1uF_50V_0805: as C24 on sheet SH2 - 5V VICOR DCDC; Package: 0805 (2012 Metric); Supplier Part Number 1: 490-11955-1-ND; Supplier 1: Digi-Key; Mount: Surface Mount; Value: 0.1μF; Case Code (Imperial): 0805; Case Code (Metric): 2012; Dielectric: X7R; Min Operating Temperature: -55°C; Max Operating Temperature: 125°C; Termination: SMD/SMT; Length: 2mm; Height: 1.25mm; Width: 0.049inch; Thickness: 0.049inch; Depth: 1.25mm; Ratings: AEC-Q200
D6 = B540C-13-F: DIODE SCHOTTKY 40V 5A SMC; Manufacturer 1: Diodes; Element Configuration: Single; Peak Reverse Current: 500uA; Peak Non-Repetitive Surge Current: 100A; Forward Voltage: 550mV; Polarity: Standard; Capacitance: 300pF; Supplier 1: Digi-Key; Manufacturer Part Number 1: B540C-13-F; Mount: Surface Mount; Case/Package: SMC; Number of Pins: 2; Weight: 0.007408oz; Contact Plating: Tin,Matte; Min Operating Temperature: -55°C; Max Operating Temperature: 125°C; Max Repetitive Reverse Voltage (Vrrm): 40V; Max Forward Surge Current (Ifsm): 100A; Average Rectified Current: 5A; Termination: SMD/SMT; Voltage Rating (DC): 40V; Current Rating: 5A; Output Current: 5A; Max Reverse Voltage (DC): 40V; Current: 5A; Length: 7.11mm; Height: 2.5mm; Width: 6.22mm; REACH SVHC: No SVHC; ComponentLink7URL: https://datasheet.ciiva.com/8303/ds13012-8303112.pdf?src-supplier=Avnet; ComponentLink7Description: https://datasheet.ciiva.com/8303/ds13012-8303112.pdf?src-supplier=Avnet; ComponentLink8URL: https://datasheet.ciiva.com/25919/ds13012-25919706.pdf?src-supplier=Avnet+Europe; ComponentLink8Description: https://datasheet.ciiva.com/25919/ds13012-25919706.pdf?src-supplier=Avnet+Europe; ComponentLink9URL: https://datasheet.ciiva.com/16200/ds13012-16200443.pdf?src-supplier=Future+Electronics; ComponentLink9Description: https://datasheet.ciiva.com/16200/ds13012-16200443.pdf?src-supplier=Future+Electronics; Supplier Part Number 1: B540C-FDIDKR-ND
D7 = DIO_LED_G: as D3 on sheet SH2 - 5V VICOR DCDC; Package: 0805 (2012 Metric); Manufacturer Part Number 1: LG R971-KN-1; Supplier Part Number 1: 475-1410-1-ND; Supplier 1: Digi-Key; Mount: Surface Mount
L3 = SRN8040-2R2Y: FIXED IND 2.2UH 6.3A 13 MOHM SMD; Manufacturer 1: Bourns; Core Material: Ferrite; Material: Steel; DC Resistance (DCR): 13mR; Tolerance: 30%; Self Resonant Frequency: 40MHz; Test Frequency: 100kHz; Shielding: Shielded; Saturation Current: 7.4A; Supplier 1: Digi-Key; Manufacturer Part Number 1: SRN8040-2R2Y; Mount: Surface Mount; Case/Package: Nonstandard; Number of Pins: 2; Weight: 0.028607oz; Contact Plating: Tin; Min Operating Temperature: -40°C; Max Operating Temperature: 125°C; Termination: SMD/SMT; Composition: Wirewound; DC Current: 6.3A; Military Standard: Not; RMS Current (Irms): 6.3A; Inductance Tolerance: 30%; Current Rating: 6.3A; Length: 8mm; Height: 4mm; Height - Seated (Max): 0.157inch; Depth: 8.3mm; Width: 8mm; REACH SVHC: No SVHC; ComponentLink7URL: https://datasheet.ciiva.com/1049/srn8040-1049455.pdf?src-supplier=Digi-Key; ComponentLink7Description: https://datasheet.ciiva.com/1049/srn8040-1049455.pdf?src-supplier=Digi-Key; ComponentLink8URL: https://datasheet.ciiva.com/17284/srn8040-17284783.pdf?src-supplier=Avnet+Europe; ComponentLink8Description: https://datasheet.ciiva.com/17284/srn8040-17284783.pdf?src-supplier=Avnet+Europe; ComponentLink9URL: https://datasheet.ciiva.com/48691/001056460-da-01-en-mag-abg-leist-ind-srn8040-2r2y-2-2uh-smd-48691836.pdf?src-supplier=Conrad; ComponentLink9Description: https://datasheet.ciiva.com/48691/001056460-da-01-en-mag-abg-leist-ind-srn8040-2r2y-2-2uh-smd-48691836.pdf?src-supplier=Conrad; Supplier Part Number 1: SRN8040-2R2YCT-ND
R10 = RES_3.3kΩ_0805: RES SMD 3.3K OHM 1% 1/8W 0805; Resistance: 3.3kR; Temperature Coefficient: 100ppm/°C; Power Rating: 125mW; Voltage Rating: 150V; Package: 0805 (2012 Metric); Supplier 1: Digi-Key; Mount: Surface Mount; Case Code (Metric): 2012; Weight: 0.000194oz; Contact Plating: Tin; Min Operating Temperature: -55°C; Max Operating Temperature: 155°C; Composition: Thick Film; Number of Terminations: 2; Termination: SMD/SMT; Max Power Dissipation: 125mW; Voltage Rating (DC): 150V; Features: Automotive AEC-Q200; Military Standard: Not; Length: 2mm; Height: 0.45mm; Width: 1.25mm; Depth: 1.25mm; REACH SVHC: Unknown; ComponentLink7URL: https://datasheet.ciiva.com/2467/dcrcwe3-2467823.pdf?src-supplier=Digi-Key; ComponentLink7Description: https://datasheet.ciiva.com/2467/dcrcwe3-2467823.pdf?src-supplier=Digi-Key; ComponentLink8URL: https://datasheet.ciiva.com/9080/dcrcwe3-9080591.pdf?src-supplier=Avnet; ComponentLink8Description: https://datasheet.ciiva.com/9080/dcrcwe3-9080591.pdf?src-supplier=Avnet; ComponentLink9URL: https://datasheet.ciiva.com/16430/dcrcwe3-16430277.pdf?src-supplier=Future+Electronics; ComponentLink9Description: https://datasheet.ciiva.com/16430/dcrcwe3-16430277.pdf?src-supplier=Future+Electronics; ComponentLink10URL: https://datasheet.ciiva.com/26312/fld-crcw-e3-data-en-26312934.pdf?src-supplier=Distrelec; ComponentLink10Description: https://datasheet.ciiva.com/26312/fld-crcw-e3-data-en-26312934.pdf?src-supplier=Distrelec; ComponentLink11URL: https://datasheet.ciiva.com/16778/70201119-16778680.pdf?src-supplier=Allied+Electronics; ComponentLink11Description: https://datasheet.ciiva.com/16778/70201119-16778680.pdf?src-supplier=Allied+Electronics; Supplier Part Number 1: 541-3.30KHCT-ND
R11 = RES_221kΩ_0805: RES SMD 221K OHM 1% 1/8W 0805; Manufacturer 1: Vishay; Manufacturer Part Number 1: CRCW0805221KFKEA; Power Rating: 125mW; Voltage Rating: 150V; Temperature Coefficient: 100ppm/°C; Resistance: 221kR; Supplier 1: Digi-Key; Mount: Surface Mount; Contact Plating: Tin; Case Code (Metric): 2012; Min Operating Temperature: -55°C; Max Operating Temperature: 155°C; Voltage Rating (DC): 150V; Composition: Thick Film; Number of Terminations: 2; Termination: SMD/SMT; Military Standard: Not; Features: Automotive AEC-Q200; Length: 2mm; Height: 0.45mm; Width: 1.25mm; Depth: 1.25mm; REACH SVHC: Unknown; ComponentLink7URL: https://datasheet.ciiva.com/2467/dcrcwe3-2467622.pdf?src-supplier=Digi-Key; ComponentLink7Description: https://datasheet.ciiva.com/2467/dcrcwe3-2467622.pdf?src-supplier=Digi-Key; ComponentLink8URL: https://datasheet.ciiva.com/3258/dcrcwe3-3258329.pdf?src-supplier=Avnet; ComponentLink8Description: https://datasheet.ciiva.com/3258/dcrcwe3-3258329.pdf?src-supplier=Avnet; Supplier Part Number 1: 541-221KCCT-ND; Max Power Dissipation: 125mW; Number of Pins: 2; Weight: 0.000194oz; ComponentLink9URL: https://datasheet.ciiva.com/7674/1533075-7674218.pdf?src-supplier=Element14; ComponentLink9Description: https://datasheet.ciiva.com/7674/1533075-7674218.pdf?src-supplier=Element14; ComponentLink10URL: https://datasheet.ciiva.com/22870/70201119-22870172.pdf?src-supplier=Allied+Electronics; ComponentLink10Description: https://datasheet.ciiva.com/22870/70201119-22870172.pdf?src-supplier=Allied+Electronics; Package: 0805 (2012 Metric)
R12 = RES_13.7kΩ_0805: RES SMD 13.7K OHM 1% 1/8W 0805; Manufacturer 1: Vishay; Manufacturer Part Number 1: CRCW080513K7FKEA; Temperature Coefficient: 100ppm/°C; Voltage Rating (DC): 150V; Power Rating: 125mW; Resistance: 13.7kR; Supplier 1: Digi-Key; Number of Pins: 2; Weight: 0.000194oz; Case Code (Metric): 2012; Contact Plating: Tin; Min Operating Temperature: -55°C; Max Operating Temperature: 155°C; Composition: Thick Film; Termination: SMD/SMT; Military Standard: Not; Length: 2mm; Height: 0.45mm; Width: 0.049inch; Depth: 1.25mm; REACH SVHC: Unknown; Supplier Part Number 1: 541-13.7KCCT-ND; Voltage Rating: 150V; Number of Terminations: 2; Max Power Dissipation: 125mW; Features: Automotive AEC-Q200; ComponentLink7URL: https://datasheet.ciiva.com/22675/1847332-22675191.pdf?src-supplier=Element14; ComponentLink7Description: https://datasheet.ciiva.com/22675/1847332-22675191.pdf?src-supplier=Element14; ComponentLink8URL: https://datasheet.ciiva.com/7663/1697337-7663928.pdf?src-supplier=Element14; ComponentLink8Description: https://datasheet.ciiva.com/7663/1697337-7663928.pdf?src-supplier=Element14; ComponentLink9URL: https://datasheet.ciiva.com/3258/dcrcwe3-3258107.pdf?src-supplier=Avnet; ComponentLink9Description: https://datasheet.ciiva.com/3258/dcrcwe3-3258107.pdf?src-supplier=Avnet; ComponentLink10URL: https://datasheet.ciiva.com/16778/70201119-16778860.pdf?src-supplier=Allied+Electronics; ComponentLink10Description: https://datasheet.ciiva.com/16778/70201119-16778860.pdf?src-supplier=Allied+Electronics; ComponentLink11URL: https://datasheet.ciiva.com/17188/dcrcwe3-17188109.pdf?src-supplier=Avnet+Europe; ComponentLink11Description: https://datasheet.ciiva.com/17188/dcrcwe3-17188109.pdf?src-supplier=Avnet+Europe; Package: 0805 (2012 Metric)
R13 = RES_10.2kΩ_0805: RES SMD 10.2K OHM 1% 1/8W 0805; Manufacturer 1: Vishay; Manufacturer Part Number 1: CRCW080510K2FKEA; Temperature Coefficient: 100ppm/°C; Power Rating: 125mW; Voltage Rating: 150V; Resistance: 10.2kR; Supplier 1: Digi-Key; Number of Pins: 2; Weight: 0.000194oz; Contact Plating: Tin; Case Code (Metric): 2012; Min Operating Temperature: -55°C; Max Operating Temperature: 155°C; Composition: Thick Film; Features: Automotive AEC-Q200; Termination: SMD/SMT; Number of Terminations: 2; Military Standard: Not; Length: 2mm; Height: 0.45mm; Width: 0.049inch; Depth: 1.25mm; REACH SVHC: Unknown; ComponentLink7URL: https://datasheet.ciiva.com/22702/1697337-22702902.pdf?src-supplier=Element14; ComponentLink7Description: https://datasheet.ciiva.com/22702/1697337-22702902.pdf?src-supplier=Element14; ComponentLink8URL: https://datasheet.ciiva.com/16204/dcrcwe3-16204135.pdf?src-supplier=Future+Electronics; ComponentLink8Description: https://datasheet.ciiva.com/16204/dcrcwe3-16204135.pdf?src-supplier=Future+Electronics; ComponentLink9URL: https://datasheet.ciiva.com/16852/dcrcwe3-16852825.pdf?src-supplier=Avnet+Europe; ComponentLink9Description: https://datasheet.ciiva.com/16852/dcrcwe3-16852825.pdf?src-supplier=Avnet+Europe; ComponentLink10URL: https://datasheet.ciiva.com/7663/1697337-7663915.pdf?src-supplier=Element14; ComponentLink10Description: https://datasheet.ciiva.com/7663/1697337-7663915.pdf?src-supplier=Element14; ComponentLink11URL: https://datasheet.ciiva.com/7663/1697337-7663916.pdf?src-supplier=Element14; ComponentLink11Description: https://datasheet.ciiva.com/7663/1697337-7663916.pdf?src-supplier=Element14; ComponentLink12URL: https://datasheet.ciiva.com/22674/1825492-22674606.pdf?src-supplier=Element14; ComponentLink12Description: https://datasheet.ciiva.com/22674/1825492-22674606.pdf?src-supplier=Element14; ComponentLink13URL: https://datasheet.ciiva.com/3258/dcrcwe3-3258031.pdf?src-supplier=Avnet; ComponentLink13Description: https://datasheet.ciiva.com/3258/dcrcwe3-3258031.pdf?src-supplier=Avnet; Supplier Part Number 1: 541-10.2KCCT-ND; Max Power Dissipation: 125mW; Package: 0805 (2012 Metric); Voltage Rating (DC): 150V; Working Voltage: 150V
R14 = RES_1kΩ_0805: as R2 on sheet SH2 - 5V VICOR DCDC; Supplier 1: Digi-Key; Case Code (Metric): 2012; Min Operating Temperature: -55°C; Max Operating Temperature: 155°C; Resistance: 1K; Tolerance: 1%; Termination: SMD/SMT; Supplier Part Number 1: 311-1.00KCRCT-ND; Package: 0805 (2012 Metric); Mount: Surface Mount; Case/Package: 0805; Number of Pins: 2; Weight: 0.000194oz; Contact Plating: Tin; Composition: Thin Film; Number of Terminations: 2; Voltage Rating (DC): 150V; Max Power Dissipation: 125mW; Features: Moisture Resistant,Automotive AEC-Q200,Anti-Sulfur; Military Standard: Not; Length: 2mm; Height: 0.022inch; Width: 0.049inch; Depth: 1.25mm; REACH SVHC: Unknown; Value: 1kΩ
R15 = RES_100kΩ_0805: as R7 on sheet SH2 - 5V VICOR DCDC; Package: 0805 (2012 Metric); Supplier Part Number 1: P123795CT-ND; Supplier 1: Digi-Key; Case Code (Metric): 2012; Tolerance: 0.5%; Min Operating Temperature: -55°C; Max Operating Temperature: 155°C; Termination: SMD/SMT; Mount: Surface Mount; Contact Plating: Tin; Composition: Thin Film; Military Standard: Not; Length: 2mm; Height: 0.5mm; Width: 1.25mm; Depth: 1.25mm; Category: Chip SMD Resistors
SW2 = SW_SPDT: as SW1 on sheet SH2 - 5V VICOR DCDC; Supplier 1: Digi-Key; Manufacturer Part Number 1: 100SP1T1B4M2QE; Mount: Through Hole; Contact Material: Silver; Contact Plating: Silver; Min Operating Temperature: -30°C; Max Operating Temperature: 85°C; Termination: PC Pin; Throw Configuration: SPDT; Orientation: Vertical; Voltage Rating (AC): 120V; Supplier Part Number 1: EG2355-ND; Current Rating: 5A
TP8 = TESTPOINT_LOOP: as TP1 on sheet SH2 - 5V VICOR DCDC; Supplier Part Number 1: 36-5002-ND; Supplier 1: Digi-Key; Mount: Through Hole
U2 = LMR14050SDDAR: IC REG BUCK ADJUSTABLE 5A 8SOPWR; Manufacturer 1: Texas Instruments; Output Configuration: Positive; Number of Outputs: 1; Min Input Voltage: 4V; Max Input Voltage: 40V; Min Output Voltage: 800mV; Max Output Voltage: 28V; Switching Frequency: 2.5MHz; Synchronous Rectifier: No; Quiescent Current: 40uA; Supplier 1: Digi-Key; Manufacturer Part Number 1: LMR14050SDDAR; Mount: Surface Mount; Number of Pins: 8; Min Operating Temperature: -40°C; Max Operating Temperature: 125°C; Output Type: Adjustable; Output Current: 5A; Case/Package: 8-PowerSOIC; Supplier Part Number 1: 296-44322-1-ND

## Nets that join several sheets
5V: SH1 - CONNECTORS (14 pins), SH2 - 5V VICOR DCDC (11 pins)
17V: SH1 - CONNECTORS (C4.2 J5.1), SH3 - 17V BUCK CONVERTER (7 pins)
GND: SH1 - CONNECTORS (18 pins), SH2 - 5V VICOR DCDC (28 pins), SH3 - 17V BUCK CONVERTER (12 pins)
VBAT: SH1 - CONNECTORS (D1.2 J1.2), SH2 - 5V VICOR DCDC (Q1.2)
VBAT_FUSED: SH2 - 5V VICOR DCDC (5 pins), SH3 - 17V BUCK CONVERTER (C29.1 R14.2 U2.2)